# Altium schematic sheet 7-segment.SchDoc
size A4; SheetNumber: 7; SheetTotal: 7
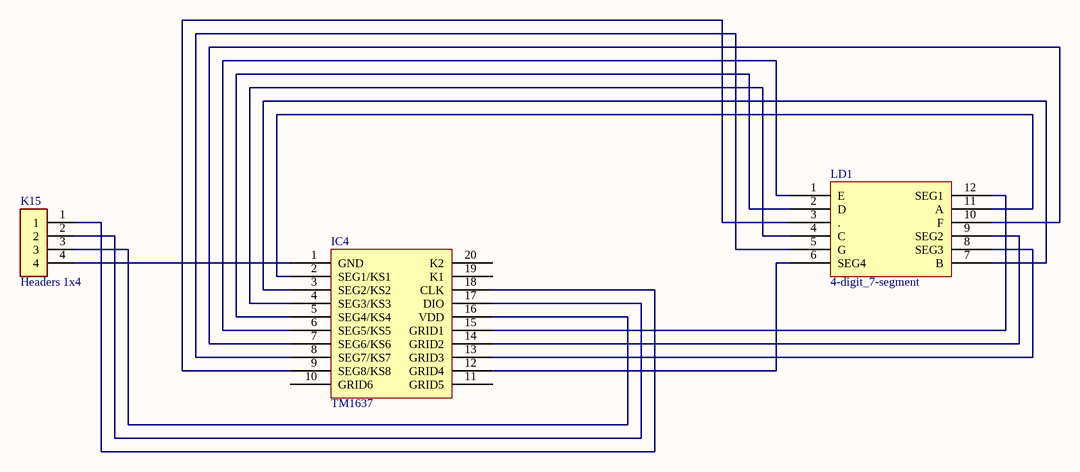
[diagram p0: 7-segment.SchDoc]

## Parts
IC4  TM1637  [TM1637]
K15  Headers 1x4  [Headers 1x4]
LD1  4-digit_7-segment  [4-digit_7-segment]

## Nets
NetIC4_1: IC4.1(GND) K15.4
NetIC4_2: IC4.2(SEG1/KS1) LD1.11(A)
NetIC4_3: IC4.3(SEG2/KS2) LD1.7(B)
NetIC4_4: IC4.4(SEG3/KS3) LD1.4(C)
NetIC4_5: IC4.5(SEG4/KS4) LD1.2(D)
NetIC4_6: IC4.6(SEG5/KS5) LD1.1(E)
NetIC4_7: IC4.7(SEG6/KS6) LD1.10(F)
NetIC4_8: IC4.8(SEG7/KS7) LD1.5(G)
NetIC4_9: IC4.9(SEG8/KS8) LD1.3(.)
NetIC4_12: IC4.12(GRID4) LD1.6(SEG4)
NetIC4_13: IC4.13(GRID3) LD1.8(SEG3)
NetIC4_14: IC4.14(GRID2) LD1.9(SEG2)
NetIC4_15: IC4.15(GRID1) LD1.12(SEG1)
NetIC4_16: IC4.16(VDD) K15.3
NetIC4_17: IC4.17(DIO) K15.2
NetIC4_18: IC4.18(CLK) K15.1

Not connected (* = marked no-connect by the designer): IC4 10(GRID6) 11(GRID5) 19(K1) 20(K2)

## Library data of the parts
IC4 = TM1637: Led Drive Control Special Circuit
K15 = Headers 1x4: Connector; Manufacturer_Name: TE Connectivity; Manufacturer_Part_Number: 2-826646-0; Datasheet Link: https://componentsearchengine.com/Datasheets/1/2-826646-0.pdf; Height: 8.8mm